# Altium schematic sheet Low_jitter_CLK_bypass.SchDoc
size A3
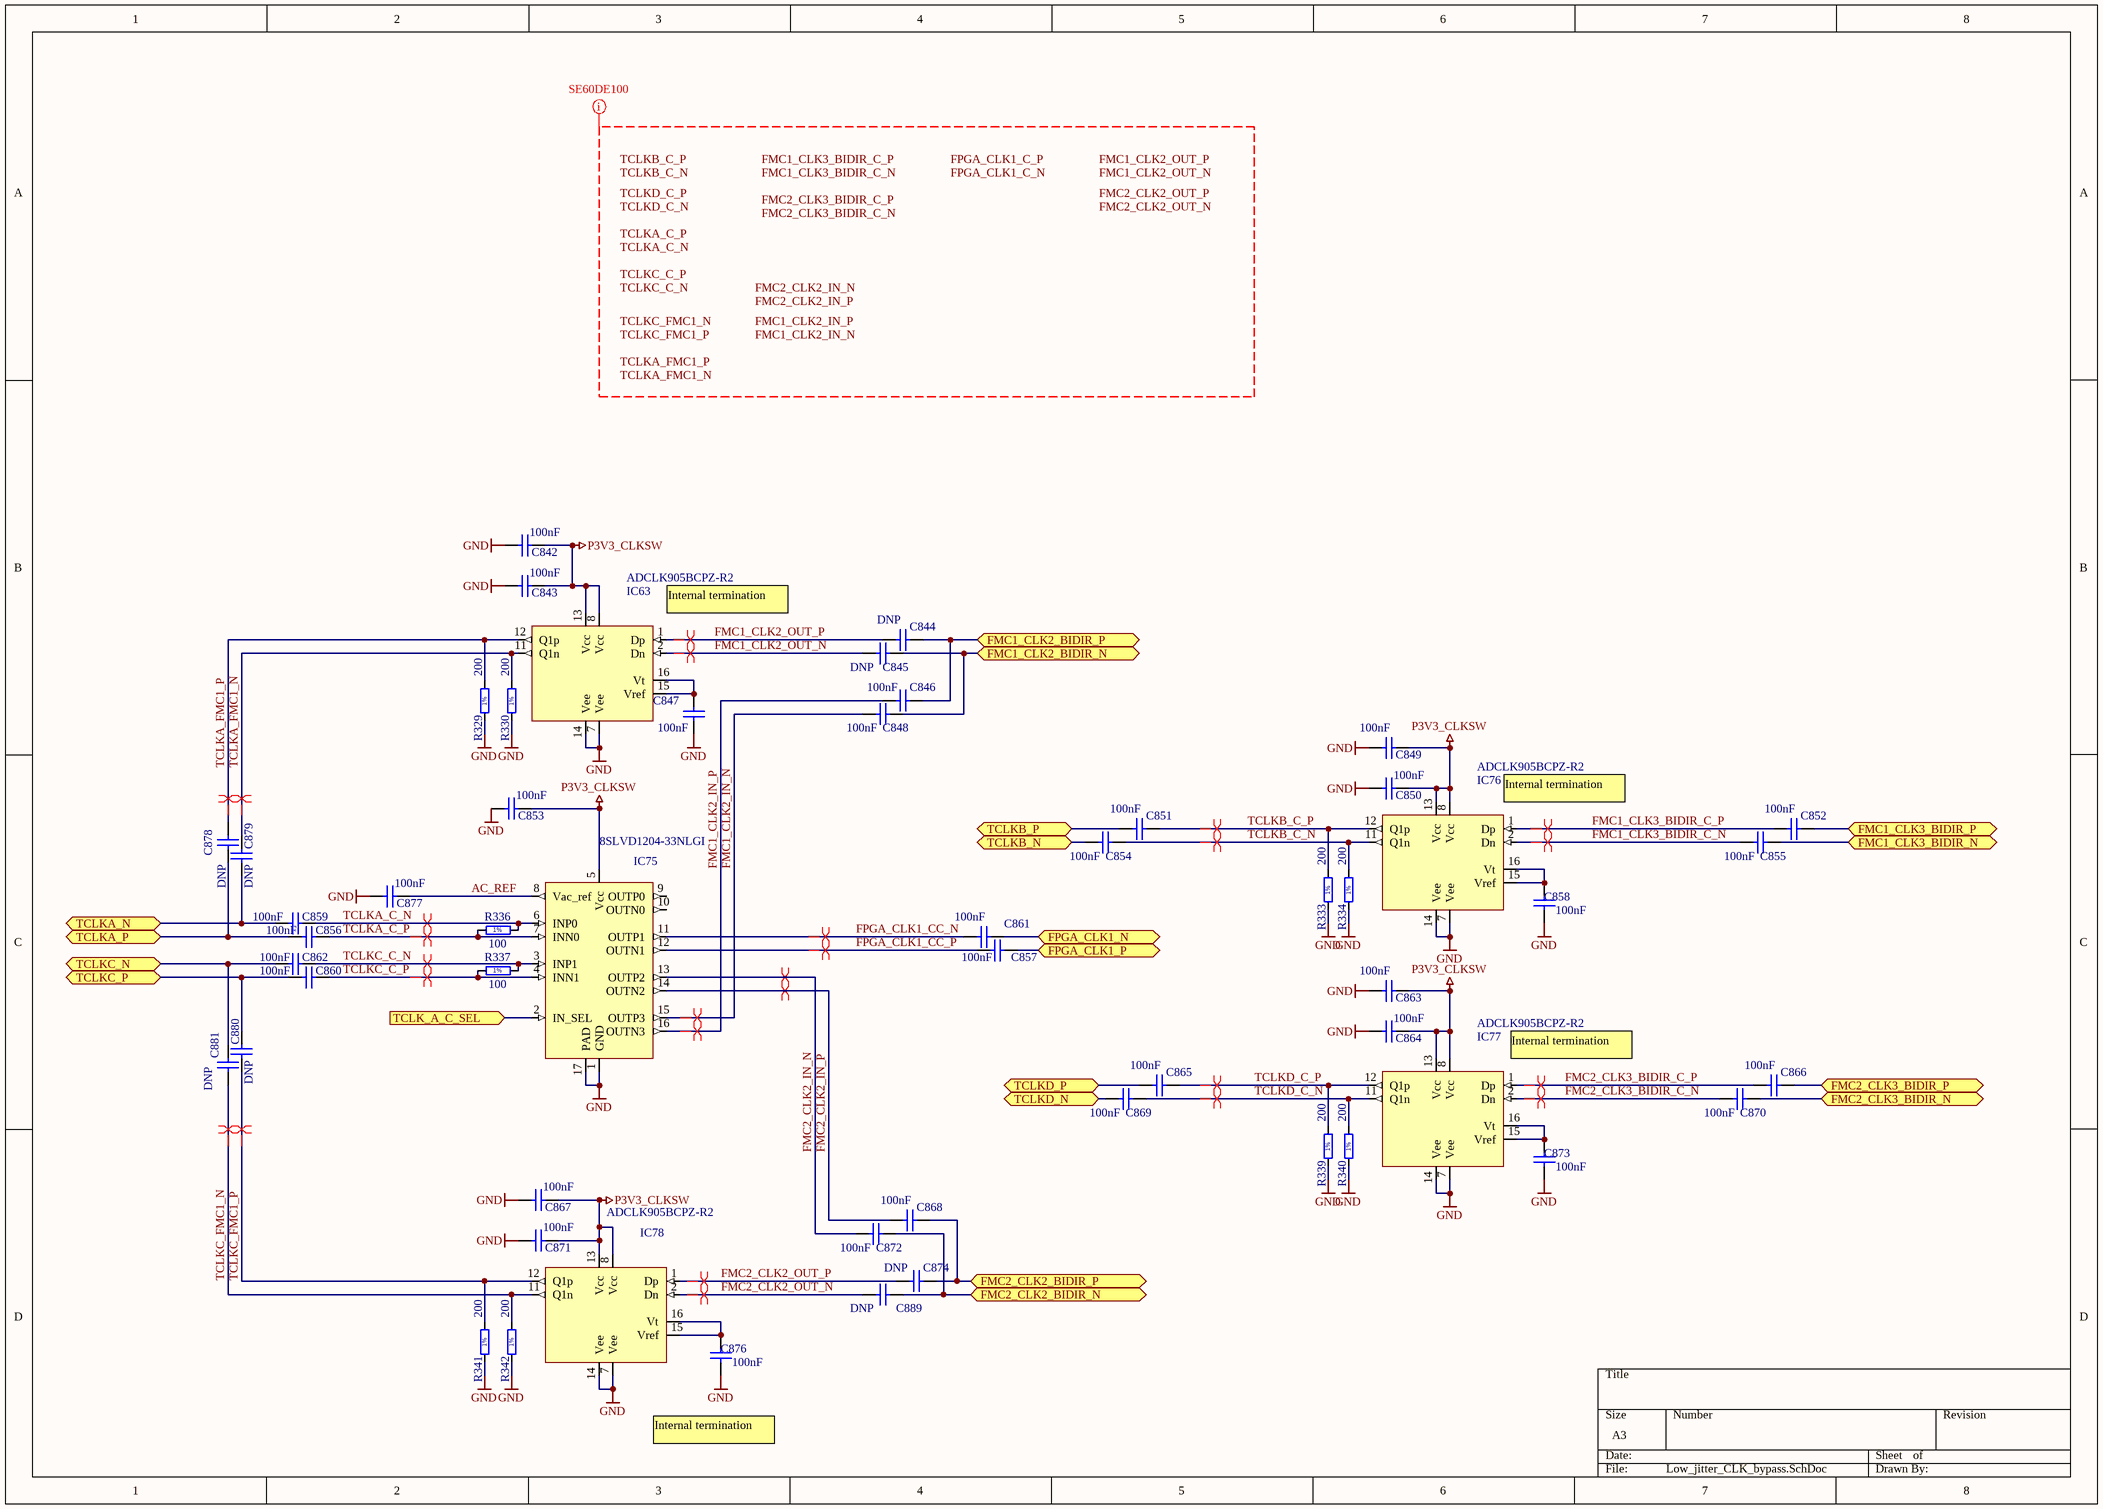
[diagram p0: Low_jitter_CLK_bypass.SchDoc]

## Parts
C842  100nF  [CAPC0603X33N]
C843  100nF  [CAPC0603X33N]
C844  DNP  [CAPC0603X33N]
C845  DNP  [CAPC0603X33N]
C846  100nF  [CAPC0603X33N]
C847  100nF  [CAPC0603X33N]
C848  100nF  [CAPC0603X33N]
C849  100nF  [CAPC0603X33N]
C850  100nF  [CAPC0603X33N]
C851  100nF  [CAPC0603X33N]
C852  100nF  [CAPC0603X33N]
C853  100nF  [CAPC0603X33N]
C854  100nF  [CAPC0603X33N]
C855  100nF  [CAPC0603X33N]
C856  100nF  [CAPC0603X33N]
C857  100nF  [CAPC0603X33N]
C858  100nF  [CAPC0603X33N]
C859  100nF  [CAPC0603X33N]
C860  100nF  [CAPC0603X33N]
C861  100nF  [CAPC0603X33N]
C862  100nF  [CAPC0603X33N]
C863  100nF  [CAPC0603X33N]
C864  100nF  [CAPC0603X33N]
C865  100nF  [CAPC0603X33N]
C866  100nF  [CAPC0603X33N]
C867  100nF  [CAPC0603X33N]
C868  100nF  [CAPC0603X33N]
C869  100nF  [CAPC0603X33N]
C870  100nF  [CAPC0603X33N]
C871  100nF  [CAPC0603X33N]
C872  100nF  [CAPC0603X33N]
C873  100nF  [CAPC0603X33N]
C874  DNP  [CAPC0603X33N]
C876  100nF  [CAPC0603X33N]
C877  100nF  [CAPC0603X33N]
C878  DNP  [CAPC0603X33N]
C879  DNP  [CAPC0603X33N]
C880  DNP  [CAPC0603X33N]
C881  DNP  [CAPC0603X33N]
C889  DNP  [CAPC0603X33N]
IC63  ADCLK905BCPZ-R2  [CP-16-3]
IC75  8SLVD1204-33NLGI  [QFN50P300X300X100-16N]
IC76  ADCLK905BCPZ-R2  [CP-16-3]
IC77  ADCLK905BCPZ-R2  [CP-16-3]
IC78  ADCLK905BCPZ-R2  [CP-16-3]
R329  200  [RESC1005X40N]
R330  200  [RESC1005X40N]
R333  200  [RESC1005X40N]
R334  200  [RESC1005X40N]
R336  100  [RESC1005X40N]
R337  100  [RESC1005X40N]
R339  200  [RESC1005X40N]
R340  200  [RESC1005X40N]
R341  200  [RESC1005X40N]
R342  200  [RESC1005X40N]

## Ports
FMC1_CLK2_BIDIR_N, FMC1_CLK2_BIDIR_P, FMC1_CLK3_BIDIR_N, FMC1_CLK3_BIDIR_P, FMC2_CLK2_BIDIR_N, FMC2_CLK2_BIDIR_P, FMC2_CLK3_BIDIR_N, FMC2_CLK3_BIDIR_P, FPGA_CLK1_N, FPGA_CLK1_P, TCLK_A_C_SEL (in), TCLKA_N, TCLKA_P, TCLKB_N, TCLKB_P, TCLKC_N, TCLKC_P, TCLKD_N, TCLKD_P

## Nets
GND: C842.1 C843.1 C847.1 C849.1 C850.1 C853.1 C858.1 C863.1 C864.1 C867.1 C871.1 C873.1 C876.1 C877.1 IC63.7(Vee) IC63.14(Vee) IC75.1(GND) IC75.17(PAD) IC76.7(Vee) IC76.14(Vee) IC77.7(Vee) IC77.14(Vee) IC78.7(Vee) IC78.14(Vee) R329.1 R330.1 R333.1 R334.1 R339.1 R340.1 R341.1 R342.1
P3V3_CLKSW: C842.2 C843.2 C849.2 C850.2 C853.2 C863.2 C864.2 C867.2 C871.2 IC63.8(Vcc) IC63.13(Vcc) IC75.5(Vcc) IC76.8(Vcc) IC76.13(Vcc) IC77.8(Vcc) IC77.13(Vcc) IC78.8(Vcc) IC78.13(Vcc)
AC_REF: C877.2 IC75.8(Vac_ref)
FMC1_CLK2_BIDIR_N: C845.2 C848.2 ; port FMC1_CLK2_BIDIR_N
FMC1_CLK2_BIDIR_P: C844.2 C846.2 ; port FMC1_CLK2_BIDIR_P
FMC1_CLK2_IN_N: C848.1 IC75.15(OUTP3)
FMC1_CLK2_IN_P: C846.1 IC75.16(OUTN3)
FMC1_CLK2_OUT_N: C845.1 IC63.2(Dn)
FMC1_CLK2_OUT_P: C844.1 IC63.1(Dp)
FMC1_CLK3_BIDIR_C_N: C855.1 IC76.2(Dn)
FMC1_CLK3_BIDIR_C_P: C852.1 IC76.1(Dp)
FMC1_CLK3_BIDIR_N: C855.2 ; port FMC1_CLK3_BIDIR_N
FMC1_CLK3_BIDIR_P: C852.2 ; port FMC1_CLK3_BIDIR_P
FMC2_CLK2_BIDIR_N: C872.2 C889.2 ; port FMC2_CLK2_BIDIR_N
FMC2_CLK2_BIDIR_P: C868.2 C874.2 ; port FMC2_CLK2_BIDIR_P
FMC2_CLK2_IN_N: C872.1 IC75.13(OUTP2)
FMC2_CLK2_IN_P: C868.1 IC75.14(OUTN2)
FMC2_CLK2_OUT_N: C889.1 IC78.2(Dn)
FMC2_CLK2_OUT_P: C874.1 IC78.1(Dp)
FMC2_CLK3_BIDIR_C_N: C870.1 IC77.2(Dn)
FMC2_CLK3_BIDIR_C_P: C866.1 IC77.1(Dp)
FMC2_CLK3_BIDIR_N: C870.2 ; port FMC2_CLK3_BIDIR_N
FMC2_CLK3_BIDIR_P: C866.2 ; port FMC2_CLK3_BIDIR_P
FPGA_CLK1_CC_N: C861.1 IC75.11(OUTP1)
FPGA_CLK1_CC_P: C857.1 IC75.12(OUTN1)
FPGA_CLK1_N: C861.2 ; port FPGA_CLK1_N
FPGA_CLK1_P: C857.2 ; port FPGA_CLK1_P
TCLK_A_C_SEL: IC75.2(IN_SEL) ; port TCLK_A_C_SEL
TCLKA_C_N: C859.2 IC75.6(INP0) R336.2
TCLKA_C_P: C856.2 IC75.7(INN0) R336.1
TCLKA_FMC1_N: C879.2 IC63.11(Q1n) R330.2
TCLKA_FMC1_P: C878.2 IC63.12(Q1p) R329.2
TCLKA_N: C859.1 C879.1 ; port TCLKA_N
TCLKA_P: C856.1 C878.1 ; port TCLKA_P
TCLKB_C_N: C854.2 IC76.11(Q1n) R334.2
TCLKB_C_P: C851.2 IC76.12(Q1p) R333.2
TCLKB_N: C854.1 ; port TCLKB_N
TCLKB_P: C851.1 ; port TCLKB_P
TCLKC_C_N: C862.2 IC75.3(INP1) R337.2
TCLKC_C_P: C860.2 IC75.4(INN1) R337.1
TCLKC_FMC1_N: C881.1 IC78.11(Q1n) R342.2
TCLKC_FMC1_P: C880.1 IC78.12(Q1p) R341.2
TCLKC_N: C862.1 C881.2 ; port TCLKC_N
TCLKC_P: C860.1 C880.2 ; port TCLKC_P
TCLKD_C_N: C869.2 IC77.11(Q1n) R340.2
TCLKD_C_P: C865.2 IC77.12(Q1p) R339.2
TCLKD_N: C869.1 ; port TCLKD_N
TCLKD_P: C865.1 ; port TCLKD_P
NetC847_2: C847.2 IC63.15(Vref) IC63.16(Vt)
NetC858_2: C858.2 IC76.15(Vref) IC76.16(Vt)
NetC873_2: C873.2 IC77.15(Vref) IC77.16(Vt)
NetC876_2: C876.2 IC78.15(Vref) IC78.16(Vt)

Not connected (* = marked no-connect by the designer): IC75 9(OUTP0) 10(OUTN0)

## Layout directives
differential pair: FMC1_CLK2_IN_N, FMC1_CLK2_IN_P, FMC1_CLK2_OUT_N, FMC1_CLK2_OUT_P, FMC1_CLK3_BIDIR_C_N, FMC1_CLK3_BIDIR_C_P, FMC2_CLK2_IN_N, FMC2_CLK2_IN_P, FMC2_CLK2_OUT_N, FMC2_CLK2_OUT_P, FMC2_CLK3_BIDIR_C_N, FMC2_CLK3_BIDIR_C_P, FPGA_CLK1_CC_N, FPGA_CLK1_CC_P, TCLKA_C_N, TCLKA_C_P, TCLKA_FMC1_N, TCLKA_FMC1_P, TCLKB_C_N, TCLKB_C_P, TCLKC_C_N, TCLKC_C_P, TCLKC_FMC1_N, TCLKC_FMC1_P, TCLKD_C_N, TCLKD_C_P
net class SE60DE100: FMC1_CLK2_IN_N, FMC1_CLK2_IN_P, FMC1_CLK2_OUT_N, FMC1_CLK2_OUT_P, FMC1_CLK3_BIDIR_C_N, FMC1_CLK3_BIDIR_C_P, FMC2_CLK2_IN_N, FMC2_CLK2_IN_P, FMC2_CLK2_OUT_N, FMC2_CLK2_OUT_P, FMC2_CLK3_BIDIR_C_N, FMC2_CLK3_BIDIR_C_P, FPGA_CLK1_C_N, FPGA_CLK1_C_P, TCLKA_C_N, TCLKA_C_P, TCLKA_FMC1_N, TCLKA_FMC1_P, TCLKB_C_N, TCLKB_C_P, TCLKC_C_N, TCLKC_C_P, TCLKC_FMC1_N, TCLKC_FMC1_P, TCLKD_C_N, TCLKD_C_P

## Notes on the sheet
- (near IC63) Internal termination
- (near IC76) Internal termination
- (near IC77) Internal termination
- Internal termination
- Labels drawn without touching a wire or pin: FMC1_CLK2_IN_N, FMC1_CLK2_IN_P, FMC1_CLK2_OUT_N, FMC1_CLK2_OUT_P, FMC1_CLK3_BIDIR_C_N, FMC1_CLK3_BIDIR_C_P, FMC2_CLK2_IN_N, FMC2_CLK2_IN_P, FMC2_CLK2_OUT_N, FMC2_CLK2_OUT_P, FMC2_CLK3_BIDIR_C_N, FMC2_CLK3_BIDIR_C_P, FPGA_CLK1_C_N, FPGA_CLK1_C_P, TCLKA_C_N, TCLKA_C_P, TCLKA_FMC1_N, TCLKA_FMC1_P, TCLKB_C_N, TCLKB_C_P, TCLKC_C_N, TCLKC_C_P, TCLKC_FMC1_N, TCLKC_FMC1_P, TCLKD_C_N, TCLKD_C_P
- (in symbol R0402_100R_1%_0.0625W_100PPM) 1%
- (in symbol R0402_200R_1%_0.0625W_100PPM) 1%

## Library data of the parts
C842 C843 C846-C873 C876 C877 = CC0201_100NF_6.3V_10%_X5R: Non-polarised capacitor; Part Description: SMD Multilayer Chip Ceramic Capacitor; Manufacturer: GENERIC; Manufacturer1 Part Number: 02016D104KAT2A; Voltage: 6.3V; TC: X5R; Tolerance: ±10%; Table: Capacitors SMD; Part Number: CC0201_100NF_6.3V_10%_X5R; Component Kind: Standard; Component Type: Standard; Pin Count: 2; Value: 100nF; Status: Not Recommended; Manufacturer Part Number: CC0201_100NF_6.3V_10%_X5R; Case: 0201; Mounted: Yes; Socket: No; SMD: Yes; Manufacturer1 Example: AVX; Manufacturer1 ComponentHeight: 0.33mm; HelpURL: \\cern.ch\dfs\Applications\Altium\Datasheets\CC0201_X5R_AVX.pdf; Author: CERN DEM JLC; CreateDate: 2007-12-03; LatestRevisionDate: 2007-12-03
C844 C845 C874 C878-C881 C889 = CC0201_100NF_6.3V_10%_X5R: Non-polarised capacitor; Part Description: SMD Multilayer Chip Ceramic Capacitor; Manufacturer: GENERIC; Manufacturer1 Part Number: 02016D104KAT2A; Value: 100nF; Voltage: 6.3V; TC: X5R; Tolerance: ±10%; Table: Capacitors SMD; Part Number: CC0201_100NF_6.3V_10%_X5R; Component Kind: Standard; Component Type: Standard; Pin Count: 2; Status: Not Recommended; Manufacturer Part Number: CC0201_100NF_6.3V_10%_X5R; Case: 0201; Mounted: Yes; Socket: No; SMD: Yes; Manufacturer1 Example: AVX; Manufacturer1 ComponentHeight: 0.33mm; HelpURL: \\cern.ch\dfs\Applications\Altium\Datasheets\CC0201_X5R_AVX.pdf; Author: CERN DEM JLC; CreateDate: 2007-12-03; LatestRevisionDate: 2007-12-03
IC63 IC76-IC78 = CLOCK_ADCLK905: clock distributor
IC75 = CLOCK_IDT8SLVD1204-33: 2:4, LVDS Output Fanout Buffer, 3.3V
R329 R330 R333 R334 R339-R342 = R0402_200R_1%_0.0625W_100PPM: Resistor - 1%; Part Description: General Purpose Thick Film Chip Resistor; Manufacturer: GENERIC; Manufacturer1 Part Number: 232270672001; TC: ±100ppm/°C; Table: Resistors SMD; Part Number: R0402_200R_1%_0.0625W_100PPM; Component Kind: Standard; Component Type: Standard; Pin Count: 2; Value: 200; Status: Not recommended; Power: 0.0625W; Tolerance: ±1%; Manufacturer Part Number: R0402_200R_1%_0.0625W_100PPM; Case: 0402; Mounted: Yes; Socket: No; SMD: Yes; Manufacturer1 Example: PHYCOMP; Manufacturer1 ComponentHeight: 0.4mm; HelpURL: \\cern.ch\dfs\Applications\Altium\Datasheets\R0402_Phycomp_RC0402.pdf; Author: CERN DEM JLC; CreateDate: 03/12/2007; LatestRevisionDate: 13/03/2008
R336 R337 = R0402_100R_1%_0.0625W_100PPM: Resistor - 1%; Part Description: General Purpose Thick Film Chip Resistor; Manufacturer: GENERIC; Manufacturer1 Part Number: 232270671001L; TC: ±100ppm/°C; Table: Resistors SMD; Part Number: R0402_100R_1%_0.0625W_100PPM; Component Kind: Standard; Component Type: Standard; Pin Count: 2; Value: 100; Status: Not recommended; Power: 0.0625W; Tolerance: ±1%; Manufacturer Part Number: R0402_100R_1%_0.0625W_100PPM; Case: 0402; Mounted: Yes; Socket: No; SMD: Yes; Manufacturer1 Example: YAGEO PHYCOMP; Manufacturer1 ComponentHeight: 0.4mm; HelpURL: \\cern.ch\dfs\Applications\Altium\Datasheets\R0402_Phycomp_RC0402.pdf; Author: CERN DEM JLC; CreateDate: 2007-12-03; LatestRevisionDate: 2012-10-17